# Altium schematic sheet IMX_1.8 V Interface Power Supply.SchDoc
size A4; SheetNumber: 4; SheetTotal: 8
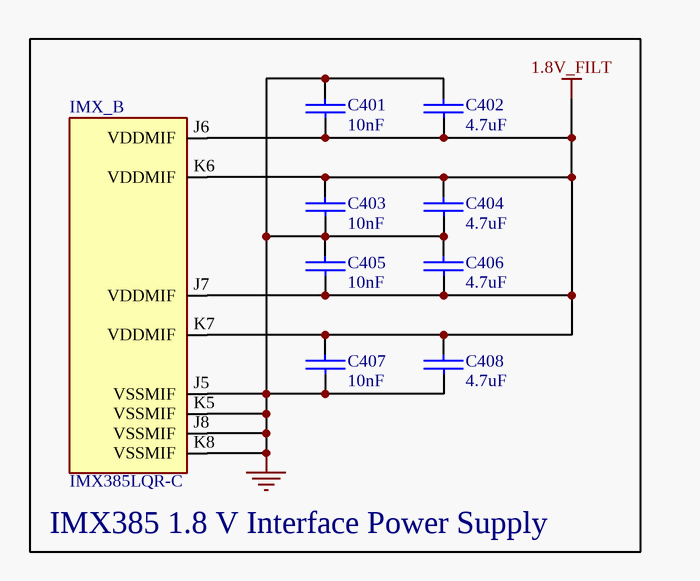
[diagram p0: IMX_1.8 V Interface Power Supply.SchDoc]

## Parts
C401  10nF  [Capacitor, 0402]
C402  4.7uF  [Capacitor, 0402]
C403  10nF  [Capacitor, 0402]
C404  4.7uF  [Capacitor, 0402]
C405  10nF  [Capacitor, 0402]
C406  4.7uF  [Capacitor, 0402]
C407  10nF  [Capacitor, 0402]
C408  4.7uF  [Capacitor, 0402]
IMX_  IMX385LQR-C  [IMX385LQR]  (part B of 6)

## Blocks framed on the sheet
IMX385 1.8 V Interface Power Supply: C401-C408 IMX_

## Nets
1.8V_FILT: C401.2 C402.2 C403.1 C404.1 C405.2 C406.2 C407.1 C408.1 IMX_.J6(VDDMIF) IMX_.J7(VDDMIF) IMX_.K6(VDDMIF) IMX_.K7(VDDMIF)
GND: C401.1 C402.1 C403.2 C404.2 C405.1 C406.1 C407.2 C408.2 IMX_.J5(VSSMIF) IMX_.J8(VSSMIF) IMX_.K5(VSSMIF) IMX_.K8(VSSMIF)

## Library data of the parts
C401 C403 C405 C407 = Capacitor, 0402, 10nF: Ceramic Capacitor, 16V, 10% +/- Tol, X7R, 10nF, SMD, 0402, #CL05B103KO5NNNC, JLC#C318577; Capacitance: 10nF
C402 C404 C406 C408 = Capacitor, 0402, 4.7uF: Ceramic Capacitor, 10V, 10% +/- Tol, X5R, 4.7uF, SMD, 0402, #CL05A475KP5NRNC, JLC#C368809; Capacitance: 4.7uF
IMX_ = IMX385LQR